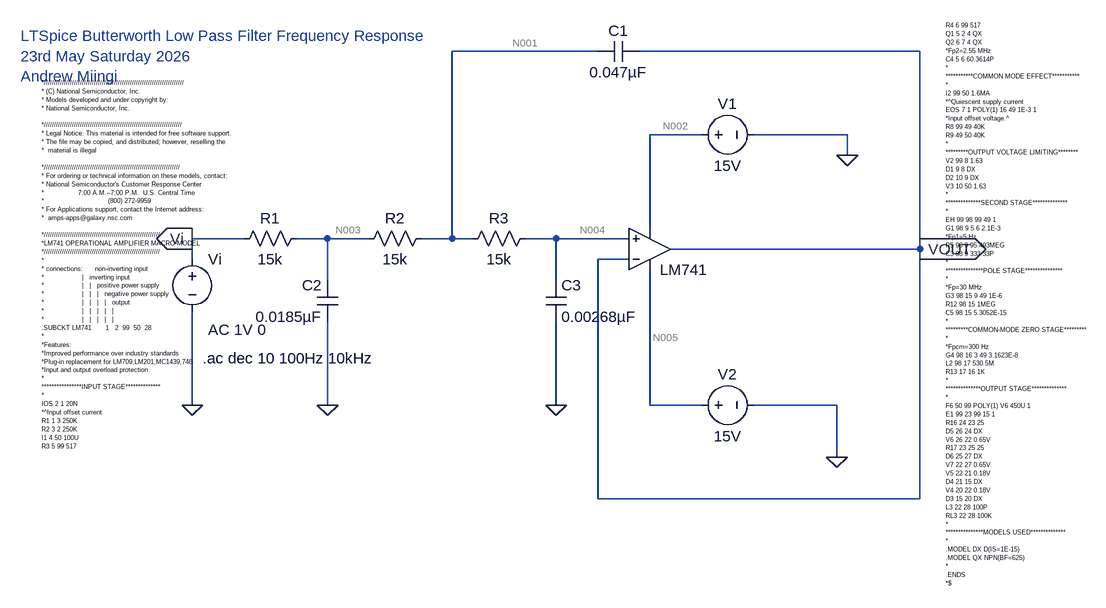
[diagram p0: schematic LTSpice_Low_Pass_Active_Filter_Frequency_Response_May_2026.asc]
LTSpice_Low_Pass_Active_Filter_Frequency_Response_May_2026.asc, the LTspice schematic file:
Version 4
SHEET 1 1312 1824
WIRE 176 -160 -48 -160
WIRE 672 -160 240 -160
WIRE 336 -32 256 -32
WIRE 560 -32 416 -32
WIRE 560 0 560 -32
WIRE 256 112 256 -32
WIRE -368 128 -448 128
WIRE -240 128 -288 128
WIRE -176 128 -240 128
WIRE -48 128 -48 -160
WIRE -48 128 -96 128
WIRE -16 128 -48 128
WIRE 112 128 64 128
WIRE 224 128 112 128
WIRE 672 144 672 -160
WIRE 672 144 288 144
WIRE -448 160 -448 128
WIRE 224 160 176 160
WIRE -240 192 -240 128
WIRE 112 192 112 128
WIRE -448 384 -448 240
WIRE -240 384 -240 256
WIRE 112 384 112 256
WIRE 256 384 256 176
WIRE 336 384 256 384
WIRE 544 384 416 384
WIRE 544 464 544 384
WIRE 176 528 176 160
WIRE 672 528 672 144
WIRE 672 528 176 528
FLAG -448 384 0
FLAG -240 384 0
FLAG 112 384 0
FLAG 560 0 0
FLAG 544 464 0
FLAG 672 144 VOUT
IOPIN 672 144 Out
FLAG -448 128 Vi
IOPIN -448 128 Out
SYMBOL OpAmps\\UniversalOpAmp 256 144 M180
SYMATTR InstName LM741
SYMBOL voltage 320 -32 R270
WINDOW 0 32 56 VTop 2
WINDOW 3 -32 56 VBottom 2
SYMATTR InstName V1
SYMATTR Value 15V
SYMBOL voltage 320 384 R270
WINDOW 0 32 56 VTop 2
WINDOW 3 -32 56 VBottom 2
SYMATTR InstName V2
SYMATTR Value 15V
SYMBOL voltage -448 144 R0
WINDOW 123 24 124 Left 2
WINDOW 39 0 0 Left 0
SYMATTR InstName Vi
SYMATTR Value ""
SYMATTR Value2 AC 1V 0
SYMBOL cap 240 -176 R90
WINDOW 0 0 32 VBottom 2
WINDOW 3 32 32 VTop 2
SYMATTR InstName C1
SYMATTR Value 0.047µF
SYMBOL cap -224 256 R180
WINDOW 0 24 56 Left 2
WINDOW 3 24 8 Left 2
SYMATTR InstName C2
SYMATTR Value 0.0185µF
SYMBOL cap 96 192 R0
SYMATTR InstName C3
SYMATTR Value 0.00268µF
SYMBOL res -272 112 R90
WINDOW 0 0 56 VBottom 2
WINDOW 3 32 56 VTop 2
SYMATTR InstName R1
SYMATTR Value 15k
SYMBOL res -80 112 R90
WINDOW 0 0 56 VBottom 2
WINDOW 3 32 56 VTop 2
SYMATTR InstName R2
SYMATTR Value 15k
SYMBOL res 80 112 R90
WINDOW 0 0 56 VBottom 2
WINDOW 3 32 56 VTop 2
SYMATTR InstName R3
SYMATTR Value 15k
TEXT -432 312 Left 2 !.ac dec 10 100Hz 10kHz
TEXT -712 -184 Left 2 ;LTSpice Butterworth Low Pass Filter Frequency Response\n23rd May Saturday 2026\nAndrew Miingi
TEXT -680 -112 Left 0 !*//////////////////////////////////////////////////////////////////////\n* (C) National Semiconductor, Inc.\n* Models developed and under copyright by:\n* National Semiconductor, Inc.  \n \n*/////////////////////////////////////////////////////////////////////\n* Legal Notice: This material is intended for free software support.\n* The file may be copied, and distributed; however, reselling the \n*  material is illegal\n \n*////////////////////////////////////////////////////////////////////\n* For ordering or technical information on these models, contact:\n* National Semiconductor's Customer Response Center\n*                 7:00 A.M.--7:00 P.M.  U.S. Central Time\n*                                (800) 272-9959\n* For Applications support, contact the Internet address:\n*  amps-apps@galaxy.nsc.com\n \n*//////////////////////////////////////////////////////////\n*LM741 OPERATIONAL AMPLIFIER MACRO-MODEL\n*//////////////////////////////////////////////////////////\n*\n* connections:      non-inverting input\n*                   |   inverting input\n*                   |   |   positive power supply\n*                   |   |   |   negative power supply\n*                   |   |   |   |   output\n*                   |   |   |   |   |\n*                   |   |   |   |   |\n.SUBCKT LM741       1   2  99  50  28\n*\n*Features:\n*Improved performance over industry standards\n*Plug-in replacement for LM709,LM201,MC1439,748\n*Input and output overload protection\n*\n****************INPUT STAGE**************\n*\nIOS 2 1 20N\n*^Input offset current\nR1 1 3 250K\nR2 3 2 250K\nI1 4 50 100U\nR3 5 99 517
TEXT 712 -200 Left 0 !R4 6 99 517\nQ1 5 2 4 QX\nQ2 6 7 4 QX\n*Fp2=2.55 MHz\nC4 5 6 60.3614P\n*\n***********COMMON MODE EFFECT***********\n*\nI2 99 50 1.6MA\n*^Quiescent supply current\nEOS 7 1 POLY(1) 16 49 1E-3 1\n*Input offset voltage.^\nR8 99 49 40K\nR9 49 50 40K\n*\n*********OUTPUT VOLTAGE LIMITING********\nV2 99 8 1.63\nD1 9 8 DX\nD2 10 9 DX\nV3 10 50 1.63\n*\n**************SECOND STAGE**************\n*\nEH 99 98 99 49 1\nG1 98 9 5 6 2.1E-3\n*Fp1=5 Hz\nR5 98 9 95.493MEG\nC3 98 9 333.33P\n*\n***************POLE STAGE***************\n*\n*Fp=30 MHz\nG3 98 15 9 49 1E-6\nR12 98 15 1MEG\nC5 98 15 5.3052E-15\n*\n*********COMMON-MODE ZERO STAGE*********\n*\n*Fpcm=300 Hz\nG4 98 16 3 49 3.1623E-8\nL2 98 17 530.5M\nR13 17 16 1K\n*\n**************OUTPUT STAGE**************\n*\nF6 50 99 POLY(1) V6 450U 1\nE1 99 23 99 15 1\nR16 24 23 25\nD5 26 24 DX\nV6 26 22 0.65V\nR17 23 25 25\nD6 25 27 DX\nV7 22 27 0.65V\nV5 22 21 0.18V\nD4 21 15 DX\nV4 20 22 0.18V\nD3 15 20 DX\nL3 22 28 100P\nRL3 22 28 100K\n*\n***************MODELS USED**************\n*\n.MODEL DX D(IS=1E-15)\n.MODEL QX NPN(BF=625)\n*\n.ENDS\n*$

The netlist it stands for:
* LTSpice_Low_Pass_Active_Filter_Frequency_Response_May_2026.asc
XLM741 N004 VOUT N005 N002 VOUT level1 Avol=1Meg GBW=10Meg Vos=0 En=0 Enk=0 In=0 Ink=0 Rin=500Meg  ; pins In+ In- V+ V- OUT
V1 N002 0 15V
V2 N005 0 15V
Vi Vi 0 AC 1V 0
C1 VOUT N001 0.047µF
C2 0 N003 0.0185µF
C3 N004 0 0.00268µF
R1 N003 Vi 15k
R2 N001 N003 15k
R3 N004 N001 15k
.ac dec 10 100Hz 10kHz
* LTSpice Butterworth Low Pass Filter Frequency Response
* 23rd May Saturday 2026
* Andrew Miingi
*//////////////////////////////////////////////////////////////////////
* (C) National Semiconductor, Inc.
* Models developed and under copyright by:
* National Semiconductor, Inc.
*/////////////////////////////////////////////////////////////////////
* Legal Notice: This material is intended for free software support.
* The file may be copied, and distributed; however, reselling the
*  material is illegal
*////////////////////////////////////////////////////////////////////
* For ordering or technical information on these models, contact:
* National Semiconductor's Customer Response Center
*                 7:00 A.M.--7:00 P.M.  U.S. Central Time
*                                (800) 272-9959
* For Applications support, contact the Internet address:
*  amps-apps@galaxy.nsc.com
*//////////////////////////////////////////////////////////
*LM741 OPERATIONAL AMPLIFIER MACRO-MODEL
*//////////////////////////////////////////////////////////
*
* connections:      non-inverting input
*                   |   inverting input
*                   |   |   positive power supply
*                   |   |   |   negative power supply
*                   |   |   |   |   output
*                   |   |   |   |   |
*                   |   |   |   |   |
.SUBCKT LM741       1   2  99  50  28
*
*Features:
*Improved performance over industry standards
*Plug-in replacement for LM709,LM201,MC1439,748
*Input and output overload protection
*
****************INPUT STAGE**************
*
IOS 2 1 20N
*^Input offset current
R1 1 3 250K
R2 3 2 250K
I1 4 50 100U
R3 5 99 517
R4 6 99 517
Q1 5 2 4 QX
Q2 6 7 4 QX
*Fp2=2.55 MHz
C4 5 6 60.3614P
*
***********COMMON MODE EFFECT***********
*
I2 99 50 1.6MA
*^Quiescent supply current
EOS 7 1 POLY(1) 16 49 1E-3 1
*Input offset voltage.^
R8 99 49 40K
R9 49 50 40K
*
*********OUTPUT VOLTAGE LIMITING********
V2 99 8 1.63
D1 9 8 DX
D2 10 9 DX
V3 10 50 1.63
*
**************SECOND STAGE**************
*
EH 99 98 99 49 1
G1 98 9 5 6 2.1E-3
*Fp1=5 Hz
R5 98 9 95.493MEG
C3 98 9 333.33P
*
***************POLE STAGE***************
*
*Fp=30 MHz
G3 98 15 9 49 1E-6
R12 98 15 1MEG
C5 98 15 5.3052E-15
*
*********COMMON-MODE ZERO STAGE*********
*
*Fpcm=300 Hz
G4 98 16 3 49 3.1623E-8
L2 98 17 530.5M
R13 17 16 1K
*
**************OUTPUT STAGE**************
*
F6 50 99 POLY(1) V6 450U 1
E1 99 23 99 15 1
R16 24 23 25
D5 26 24 DX
V6 26 22 0.65V
R17 23 25 25
D6 25 27 DX
V7 22 27 0.65V
V5 22 21 0.18V
D4 21 15 DX
V4 20 22 0.18V
D3 15 20 DX
L3 22 28 100P
RL3 22 28 100K
*
***************MODELS USED**************
*
.MODEL DX D(IS=1E-15)
.MODEL QX NPN(BF=625)
*
.ENDS
*$
.lib UniversalOpAmp1.lib
.backanno
.end

* Results of the author's LTspice run, read from the files saved beside the schematic
* Operating Point, zero values left out:
*   V(vout) = 1.35 mV
*   V(n004) = 1.35 mV
*   V(n005) = 15 V
*   V(n002) = 15 V
*   V(n001) = 899.9 µV
*   V(n003) = 450 µV
*   I(R3) = 30 nA
*   I(R2) = 30 nA
*   I(R1) = 30 nA
*   I(Vi) = 30 nA
*   I(V2) = -30 nA
*   I(V1) = -30 nA
*   Ix(lm741:1) = -30 nA
*   Ix(lm741:2) = -30 nA
*   Ix(lm741:3) = 30 nA
*   Ix(lm741:4) = 30 nA
*   Ix(lm741:5) = 29.48 nA